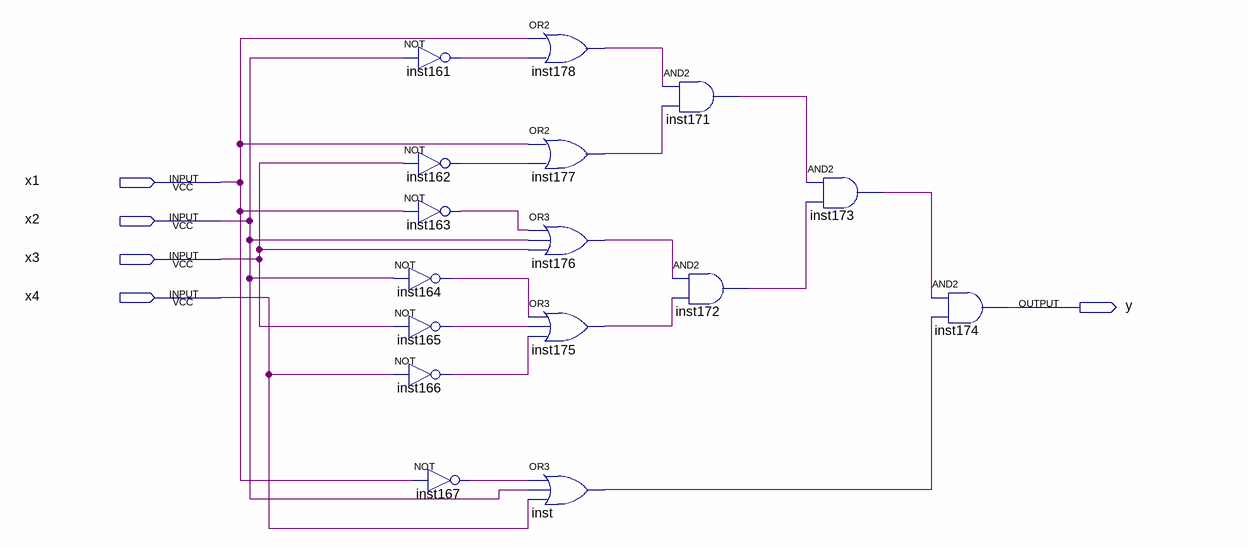
[diagram p0: schematic sheet]
// Quartus schematic block_name.bdf as structural Verilog: 16 symbols, 5 pins
module block_name (
  input  x1,
  input  x2,
  input  x3,
  input  x4,
  output y
);

  wire inst161_out, inst162_out, inst163_out, inst164_out, inst165_out, inst166_out, inst167_out,
       inst171_out, inst172_out, inst173_out, inst175_out, inst176_out, inst177_out, inst178_out, inst_out;

  not inst164 (inst164_out, x2);
  not inst165 (inst165_out, x3);
  not inst166 (inst166_out, x4);
  not inst161 (inst161_out, x2);
  not inst162 (inst162_out, x3);
  not inst163 (inst163_out, x1);
  not inst167 (inst167_out, x1);
  or inst178 (inst178_out, x1, inst161_out);
  or inst177 (inst177_out, x1, inst162_out);
  or inst176 (inst176_out, inst163_out, x2, x3);
  or inst175 (inst175_out, inst164_out, inst165_out, inst166_out);
  or inst (inst_out, inst167_out, x2, x4);
  and inst171 (inst171_out, inst178_out, inst177_out);
  and inst172 (inst172_out, inst176_out, inst175_out);
  and inst173 (inst173_out, inst171_out, inst172_out);
  and inst174 (y, inst173_out, inst_out);
endmodule
